# Altium schematic sheet QCopterMV_LED_Sch.SchDoc
size A4
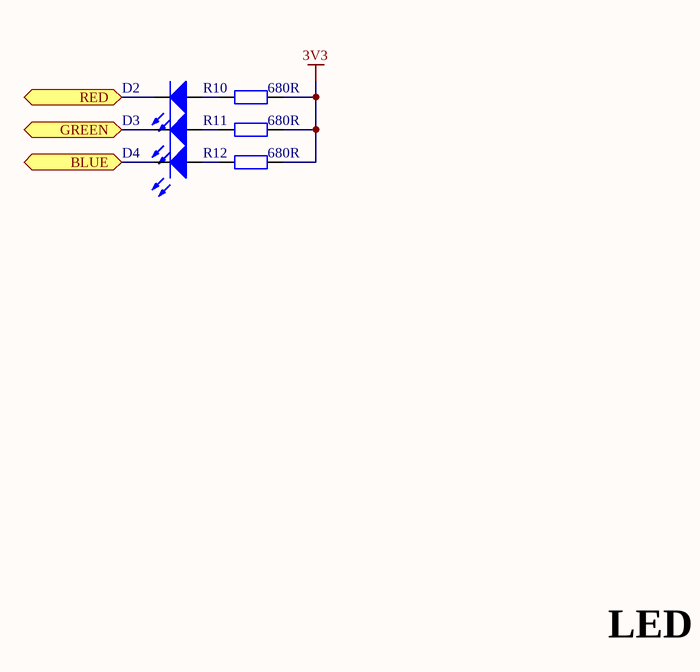
[diagram p0: QCopterMV_LED_Sch.SchDoc]

## Parts
D2  LED_0603_RED  [LED_0603_RED]  (value not drawn)
D3  LED_0603_GREEN  [LED_0603_GREEN]  (value not drawn)
D4  LED_0603_BLUE  [LED_0603_BLUE]  (value not drawn)
R10  value 680R  [RES_0603]  (hidden comment: Res_0603)
R11  value 680R  [RES_0603]  (hidden comment: Res_0603)
R12  value 680R  [RES_0603]  (hidden comment: Res_0603)

## Ports
BLUE, GREEN, RED

## Nets
3V3: R10.2 R11.2 R12.2
BLUE: D4.2(K) ; port BLUE
GREEN: D3.2(K) ; port GREEN
RED: D2.2(K) ; port RED
NetD2_1: D2.1(A) R10.1
NetD3_1: D3.1(A) R11.1
NetD4_1: D4.1(A) R12.1

## Notes on the sheet
- LED

## Library data of the parts
D2 = LED_0603_RED: LED
D3 = LED_0603_GREEN: LED
D4 = LED_0603_BLUE: LED
R10-R12 = Res_0603: Resistor